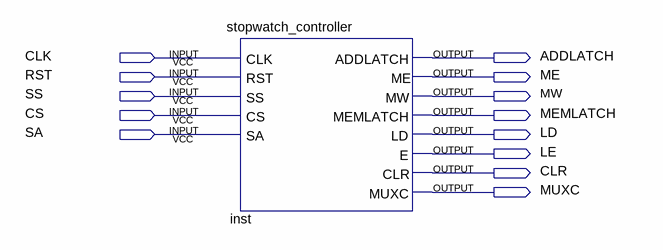
[diagram p0: schematic sheet]
// Quartus schematic LAB3.bdf as structural Verilog: 1 symbols, 13 pins
module LAB3 (
  input  CLK,
  input  RST,
  input  SS,
  input  CS,
  input  SA,
  output ADDLATCH,
  output ME,
  output MW,
  output MEMLATCH,
  output LD,
  output LE,
  output CLR,
  output MUXC
);

  stopwatch_controller inst (
    .CLK(CLK), .RST(RST), .SS(SS), .CS(CS), .SA(SA), .ADDLATCH(ADDLATCH), .ME(ME), .MW(MW),
    .MEMLATCH(MEMLATCH), .LD(LD), .E(LE), .CLR(CLR), .MUXC(MUXC));
endmodule
